# Altium project project_a_box.PrjPCB
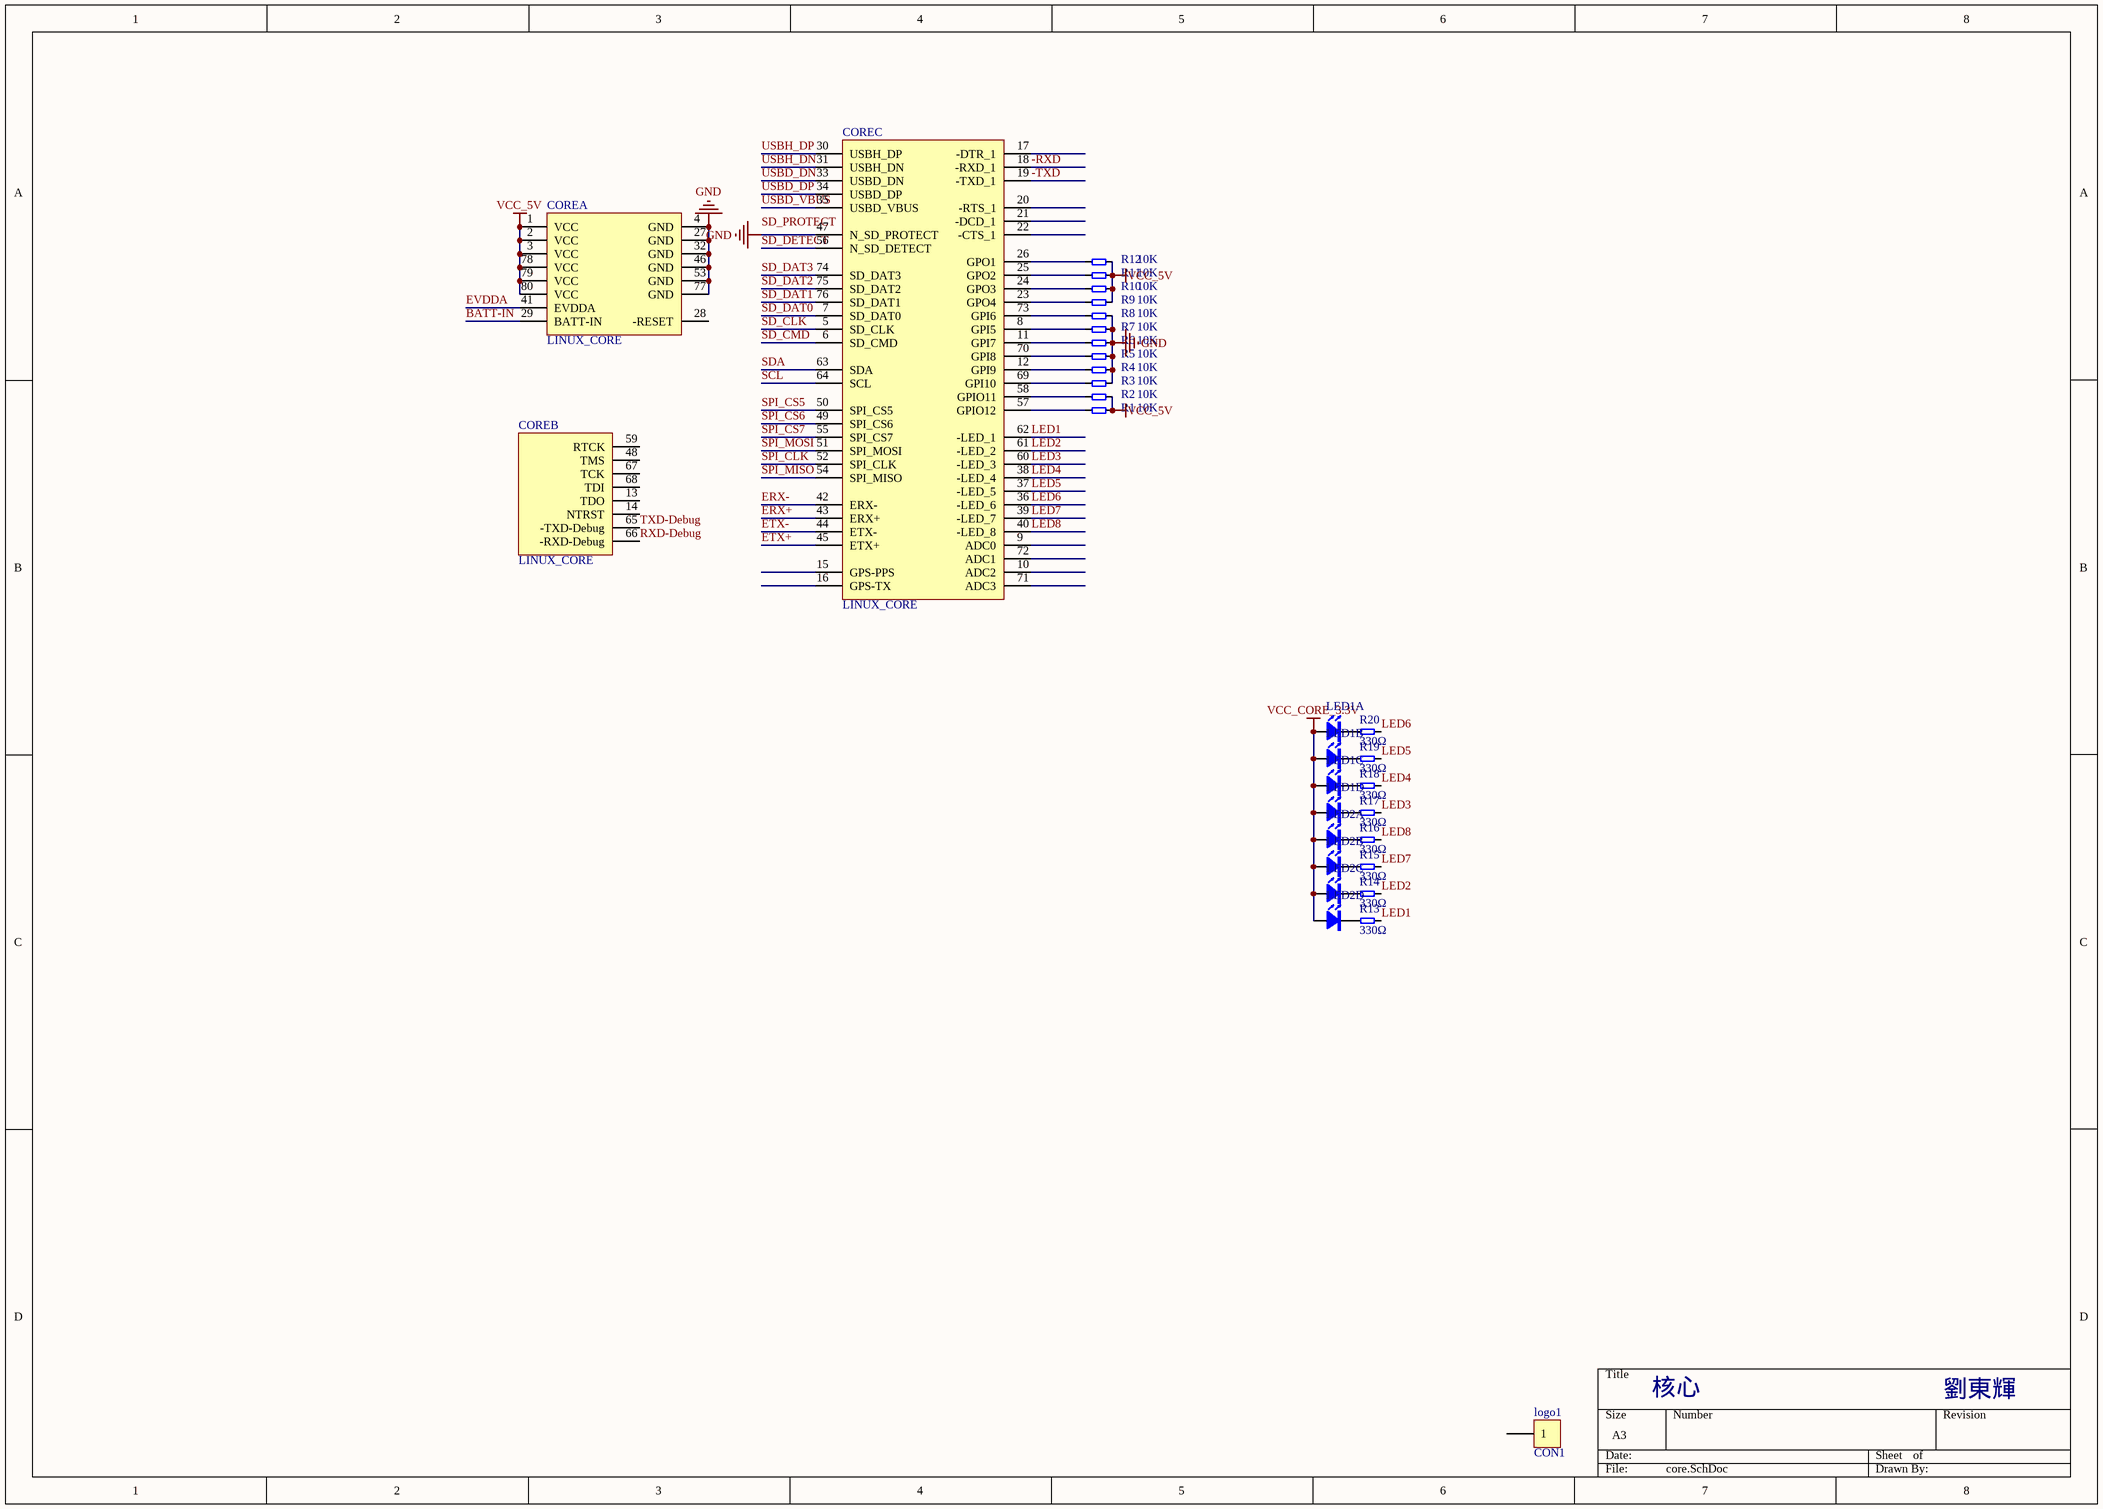
[diagram p0: core.SchDoc]
4 sheets, 100 parts. Net scope: global (net labels, ports and power ports of the same name join across sheets).
Board files: pcb.PcbDoc, panel.PcbDoc
Sheets:
  core.SchDoc
  Interface.SchDoc
  Power.SchDoc
  Ethernet.SchDoc

## Sheet core.SchDoc
size A3

### Parts
CORE  LINUX_CORE  [LINUX_CORE]  (parts A,B,C of 3)
LED1  (no value)  [3MM-4SYG/S530-Z]  (parts A,B,C,D of 4)
LED2  (no value)  [3MM-4SYG/S530-Z]  (parts A,B,C,D of 4)
logo1  CON1  [LIU]
R1  10K  [0805/2012 R3]
R2  10K  [0805/2012 R3]
R3  10K  [0805/2012 R3]
R4  10K  [0805/2012 R3]
R5  10K  [0805/2012 R3]
R6  10K  [0805/2012 R3]
R7  10K  [0805/2012 R3]
R8  10K  [0805/2012 R3]
R9  10K  [0805/2012 R3]
R10  10K  [0805/2012 R3]
R11  10K  [0805/2012 R3]
R12  10K  [0805/2012 R3]
R13  330Ω  [0805/2012 R3]
R14  330Ω  [0805/2012 R3]
R15  330Ω  [0805/2012 R3]
R16  330Ω  [0805/2012 R3]
R17  330Ω  [0805/2012 R3]
R18  330Ω  [0805/2012 R3]
R19  330Ω  [0805/2012 R3]
R20  330Ω  [0805/2012 R3]

### Nets
GND: CORE.4(GND) CORE.27(GND) CORE.32(GND) CORE.46(GND) CORE.47(N_SD_PROTECT) CORE.53(GND) CORE.77(GND) R3.2 R4.2 R5.2 R6.2 R7.2 R8.2
VCC_5V: CORE.1(VCC) CORE.2(VCC) CORE.3(VCC) CORE.78(VCC) CORE.79(VCC) CORE.80(VCC) R1.2 R2.2 R9.2 R10.2 R11.2 R12.2
VCC_CORE_3.3V: LED1.1(1A) LED1.3(2A) LED1.5(3A) LED1.7(4A) LED2.1(1A) LED2.3(2A) LED2.5(3A) LED2.7(4A)
-RXD: CORE.18(-RXD_1)
-TXD: CORE.19(-TXD_1)
BATT-IN: CORE.29(BATT-IN)
ERX+: CORE.43(ERX+)
ERX-: CORE.42(ERX-)
ETX+: CORE.45(ETX+)
ETX-: CORE.44(ETX-)
EVDDA: CORE.41(EVDDA)
LED1: CORE.62(-LED_1) R13.2
LED2: CORE.61(-LED_2) R14.2
LED3: CORE.60(-LED_3) R17.2
LED4: CORE.38(-LED_4) R18.2
LED5: CORE.37(-LED_5) R19.2
LED6: CORE.36(-LED_6) R20.2
LED7: CORE.39(-LED_7) R15.2
LED8: CORE.40(-LED_8) R16.2
RXD-Debug: CORE.66(-RXD-Debug)
SCL: CORE.64(SCL)
SD_CLK: CORE.5(SD_CLK)
SD_CMD: CORE.6(SD_CMD)
SD_DAT0: CORE.7(SD_DAT0)
SD_DAT1: CORE.76(SD_DAT1)
SD_DAT2: CORE.75(SD_DAT2)
SD_DAT3: CORE.74(SD_DAT3)
SD_DETECT: CORE.56(N_SD_DETECT)
SDA: CORE.63(SDA)
SPI_CLK: CORE.52(SPI_CLK)
SPI_CS5: CORE.50(SPI_CS5)
SPI_CS6: CORE.49(SPI_CS6)
SPI_CS7: CORE.55(SPI_CS7)
SPI_MISO: CORE.54(SPI_MISO)
SPI_MOSI: CORE.51(SPI_MOSI)
TXD-Debug: CORE.65(-TXD-Debug)
USBD_DN: CORE.33(USBD_DN)
USBD_DP: CORE.34(USBD_DP)
USBD_VBUS: CORE.35(USBD_VBUS)
USBH_DN: CORE.31(USBH_DN)
USBH_DP: CORE.30(USBH_DP)
NetCORE_8: CORE.8(GPI5) R7.1
NetCORE_11: CORE.11(GPI7) R6.1
NetCORE_12: CORE.12(GPI9) R4.1
NetCORE_23: CORE.23(GPO4) R9.1
NetCORE_24: CORE.24(GPO3) R10.1
NetCORE_25: CORE.25(GPO2) R11.1
NetCORE_26: CORE.26(GPO1) R12.1
NetCORE_57: CORE.57(GPIO12) R1.1
NetCORE_58: CORE.58(GPIO11) R2.1
NetCORE_69: CORE.69(GPI10) R3.1
NetCORE_70: CORE.70(GPI8) R5.1
NetCORE_73: CORE.73(GPI6) R8.1
NetLED1_2: LED1.2(1K) R20.1
NetLED1_4: LED1.4(2K) R19.1
NetLED1_6: LED1.6(3K) R18.1
NetLED1_8: LED1.8(4K) R17.1
NetLED2_2: LED2.2(1K) R16.1
NetLED2_4: LED2.4(2K) R15.1
NetLED2_6: LED2.6(3K) R14.1
NetLED2_8: LED2.8(4K) R13.1

Not connected (* = marked no-connect by the designer): CORE 9(ADC0) 10(ADC2) 13(TDO) 14(NTRST) 15(GPS-PPS) 16(GPS-TX) 17(-DTR_1) 20(-RTS_1) 21(-DCD_1) 22(-CTS_1) 28(-RESET) 48(TMS) 59(RTCK) 67(TCK) 68(TDI) 71(ADC3) 72(ADC1); logo1 1

### Notes on the sheet
- 核心
- 劉東輝
- Labels drawn without touching a wire or pin: SD_PROTECT

### Library data of the parts
LED1 LED2 = 3MM-4SYG/S530-Z
logo1 = CON1: Connector
R1-R20 = RES2: Resistor

## Sheet Interface.SchDoc
size A4
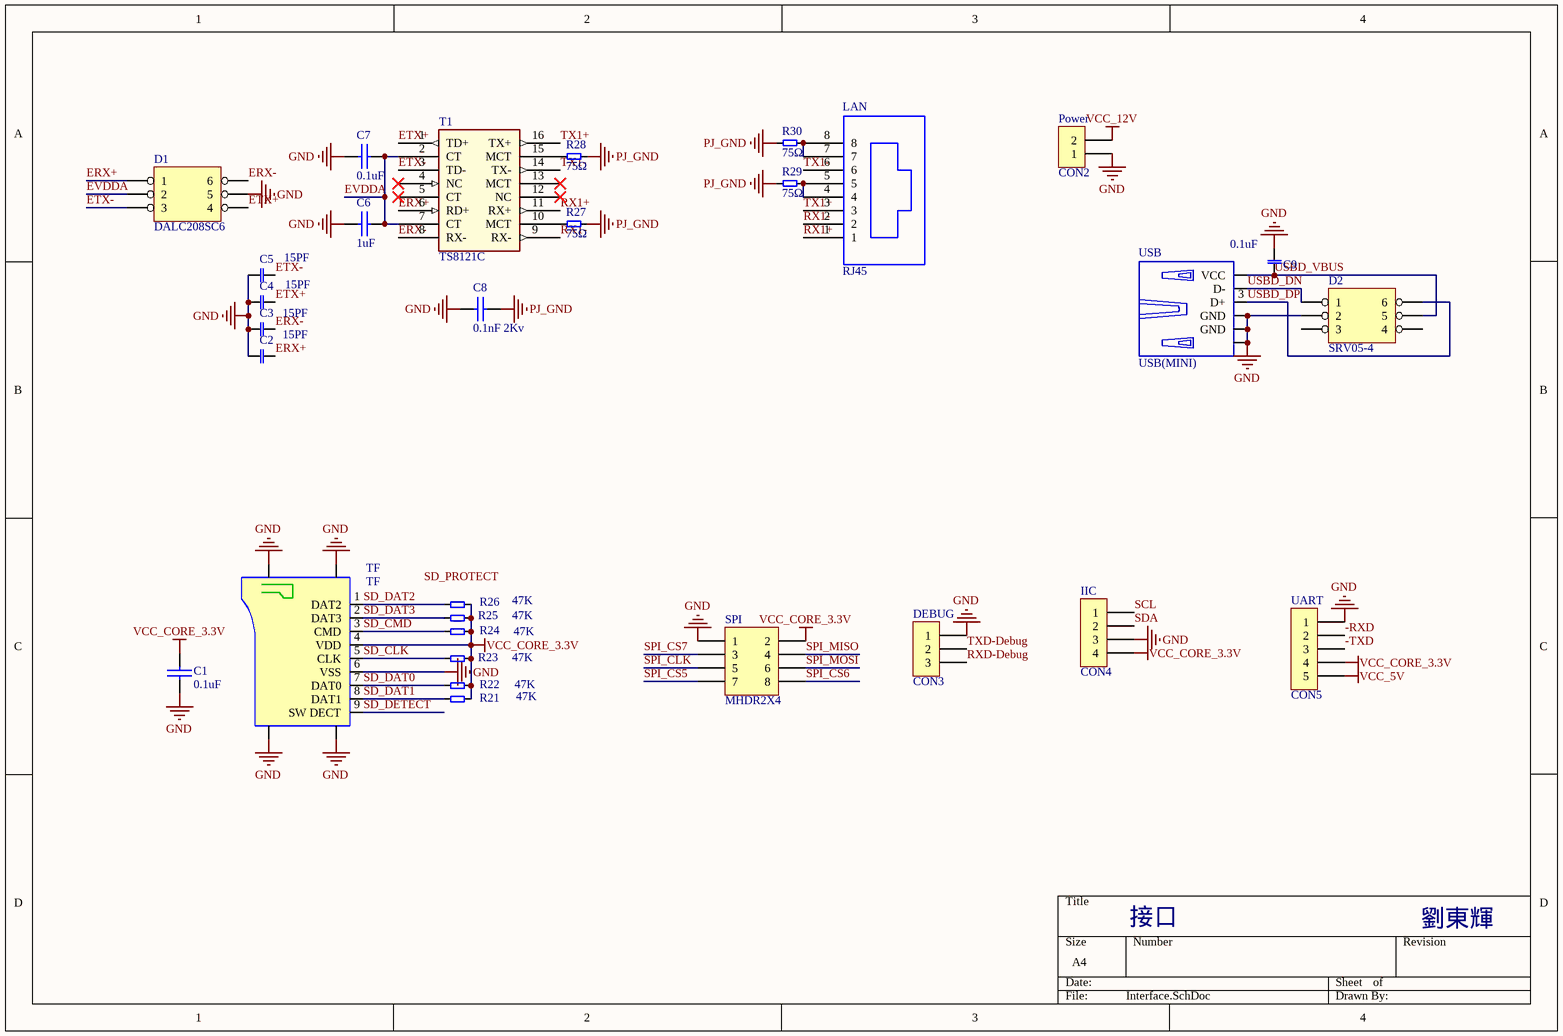
[diagram p1: Interface.SchDoc]

### Parts
C1  0.1uF  [0805/2012 C3]
C2  15PF  [0805/2012 C3]
C3  15PF  [0805/2012 C3]
C4  15PF  [0805/2012 C3]
C5  15PF  [0805/2012 C3]
C6  1uF  [0805/2012 C3]
C7  0.1uF  [0805/2012 C3]
C8  0.1nF 2Kv  [CAPRR508-350X650X700]
C9  0.1uF  [0805/2012 C3]
D1  DALC208SC6  [TSOT-23_6]
D2  SRV05-4  [TSOT-23_6]
DEBUG  CON3  [COMATEL_385.0358.1.03.400]
IIC  CON4  [COMATEL_385.0358.1.04.400]
LAN  RJ45  [RJ45_8P_8C]
Power  CON2  [B2P-VH]
R21  47K  [0805/2012 R3]
R22  47K  [0805/2012 R3]
R23  47K  [0805/2012 R3]
R24  47K  [0805/2012 R3]
R25  47K  [0805/2012 R3]
R26  47K  [0805/2012 R3]
R27  75Ω  [0805/2012 R3]
R28  75Ω  [0805/2012 R3]
R29  75Ω  [0805/2012 R3]
R30  75Ω  [0805/2012 R3]
SPI  MHDR2X4  [M20N-2X04-2.54]
T1  TS8121C  [XFMR_PULSE_H1260NL]
TF  TF  [TFP09-2-12B-G]
UART  CON5  [COMATEL_386.0358.1.05.440]
USB  USB(MINI)  [WURTH_651005136521]

### Nets
GND: C1.2 C2.2 C3.2 C4.1 C5.2 C6.1 C7.1 C8.2 C9.1 D1.5 D2.2 DEBUG.1 IIC.3 Power.1 SPI.1 TF.6(VSS) TF.10(GND) TF.11(GND) TF.12(GND) TF.13(GND) UART.1 USB.4(GND) USB.5(GND) USB.6
PJ_GND: C8.1 LAN.0(GND) R27.2 R28.2 R29.1 R30.1
VCC_5V: UART.5
VCC_12V: Power.2
VCC_CORE_3.3V: C1.1 IIC.4 R21.2 R22.2 R23.2 R24.2 R25.2 R26.2 SPI.2 TF.4(VDD) UART.4
-RXD: UART.2
-TXD: UART.3
ERX+: C2.1 D1.1 T1.6(RD+)
ERX-: C3.1 D1.6 T1.8(RX-)
ETX+: C4.2 D1.4 T1.1(TD+)
ETX-: C5.1 D1.3 T1.3(TD-)
EVDDA: C6.2 C7.2 D1.2 T1.2(CT) T1.7(CT)
RX1+: LAN.1 T1.11(RX+)
RX1-: LAN.2 T1.9(RX-)
RXD-Debug: DEBUG.3
SCL: IIC.1
SD_CLK: R23.1 TF.5(CLK)
SD_CMD: R24.1 TF.3(CMD)
SD_DAT0: R22.1 TF.7(DAT0)
SD_DAT1: R21.1 TF.8(DAT1)
SD_DAT2: R26.1 TF.1(DAT2)
SD_DAT3: R25.1 TF.2(DAT3)
SD_DETECT: TF.9(SW_DECT)
SDA: IIC.2
SPI_CLK: SPI.5
SPI_CS5: SPI.7
SPI_CS6: SPI.8
SPI_CS7: SPI.3
SPI_MISO: SPI.4
SPI_MOSI: SPI.6
TX1+: LAN.3 T1.16(TX+)
TX1-: LAN.6 T1.14(TX-)
TXD-Debug: DEBUG.2
USBD_DN: D2.1 USB.2(D-)
USBD_DP: D2.6 USB.3(D+)
USBD_VBUS: C9.2 D2.5 USB.1(VCC)
NetLAN_4: LAN.4 LAN.5 R29.2
NetLAN_7: LAN.7 LAN.8 R30.2
NetR27_1: R27.1 T1.10(MCT)
NetR28_1: R28.1 T1.15(MCT)

Not connected (* = marked no-connect by the designer): D2 3 4; T1 4(NC)* 5(CT)* 12(NC)* 13(MCT)*

### Notes on the sheet
- 接口
- 劉東輝
- Labels drawn without touching a wire or pin: SD_PROTECT

### Library data of the parts
C1 C6-C8 = Pro39.tmp_22P_32
C2-C5 C9 = CAP: Capacitor
D1 D2 = HEADER 3X2
DEBUG = CON3: Connector
IIC = CON4: Connector
Power = CON2: Connector
R21-R30 = RES2: Resistor
SPI = MHDR2X4: Header, 4-Pin, Dual row
UART = CON5: Connector
USB = USB(MINI): USB-MINI

## Sheet Power.SchDoc
size A4
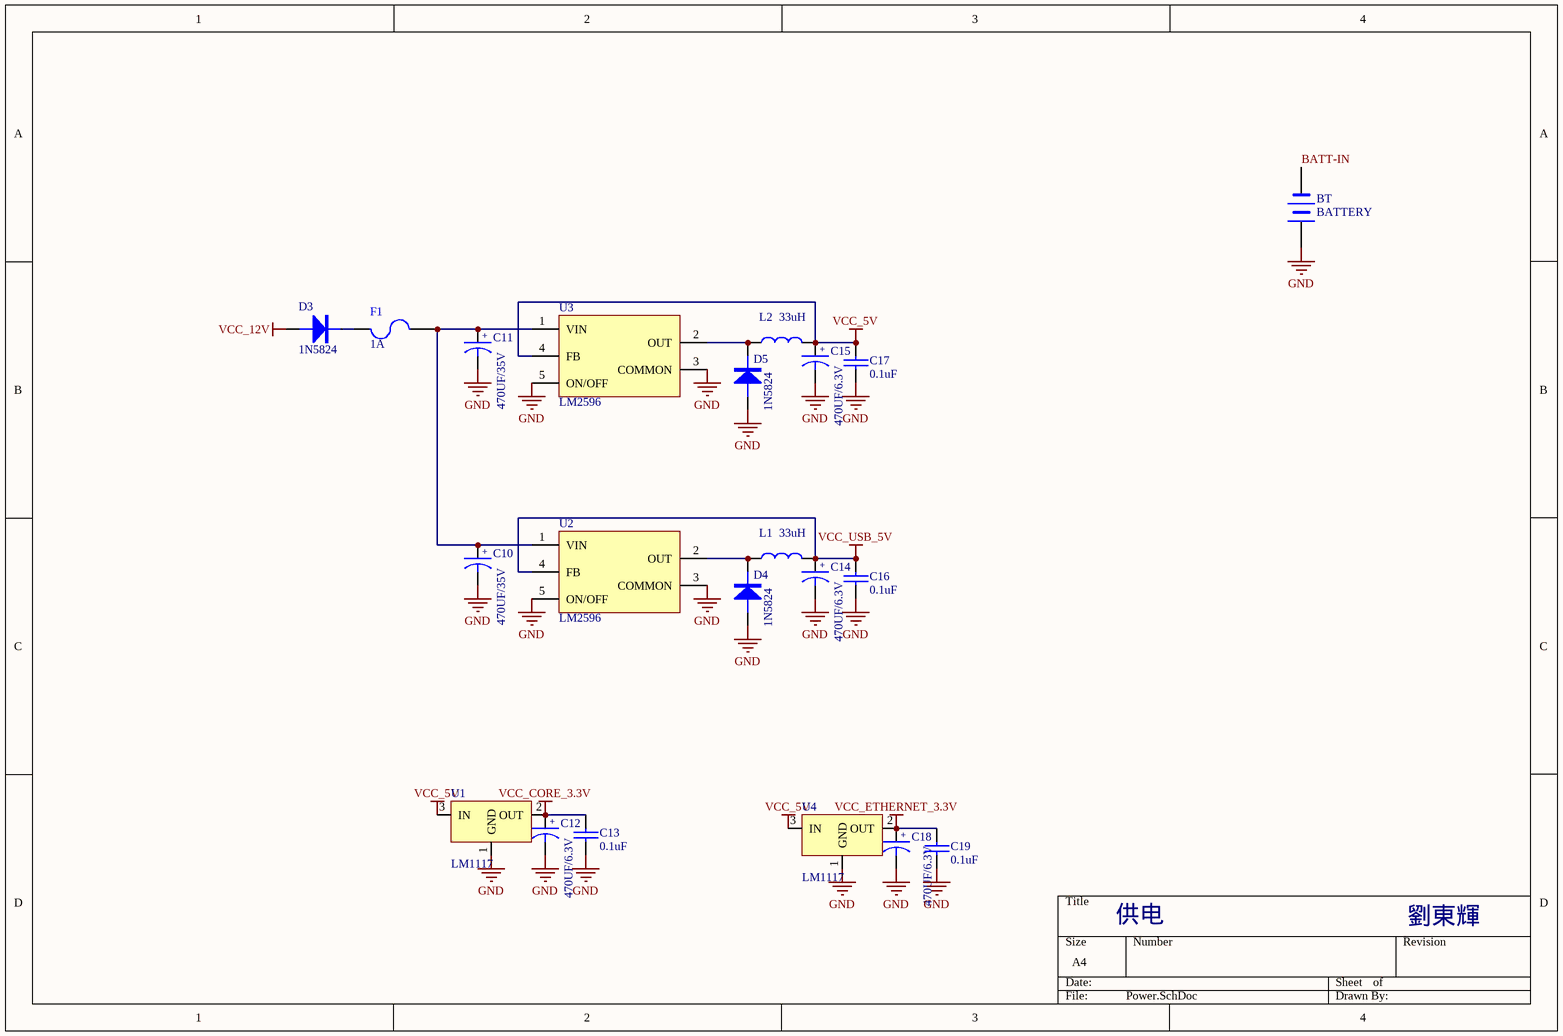
[diagram p2: Power.SchDoc]

### Parts
BT  BATTERY  [CR-1220]
C10  470UF/35V  [SMT_10X10_3-AECAP]
C11  470UF/35V  [SMT_10X10_3-AECAP]
C12  470UF/6.3V  [SMT_6_3X7_7-AECAP]
C13  0.1uF  [0805/2012 C3]
C14  470UF/6.3V  [SMT_6_3X7_7-AECAP]
C15  470UF/6.3V  [SMT_6_3X7_7-AECAP]
C16  0.1uF  [0805/2012 C3]
C17  0.1uF  [0805/2012 C3]
C18  470UF/6.3V  [SMT_6_3X7_7-AECAP]
C19  0.1uF  [0805/2012 C3]
D3  1N5824  [DO-214AC]
D4  1N5824  [DO-214AC]
D5  1N5824  [DO-214AC]
F1  1A  [FUSR_BOURNS_MF-MSMF_STYLE1(H85)]
L1  33uH  [MS125]
L2  33uH  [MS125]
U1  LM1117  [SOT-223]
U2  LM2596  [TO-263-B]
U3  LM2596  [TO-263-B]
U4  LM1117  [SOT-223]

### Nets
GND: BT.1(+) C10.2 C11.2 C12.2 C13.2 C14.2 C15.2 C16.2 C17.2 C18.2 C19.2 D4.1(A) D5.1(A) U1.1(GND) U2.0(GND) U2.3(COMMON) U2.5(ON/OFF) U3.0(GND) U3.3(COMMON) U3.5(ON/OFF) U4.1(GND)
VCC_5V: C15.1 C17.1 L2.1 U1.3(IN) U3.4(FB) U4.3(IN)
VCC_12V: D3.1(A)
VCC_CORE_3.3V: C12.1 C13.1 U1.2(OUT) U1.4(VCC_CORE_3.3V)
VCC_ETHERNET_3.3V: C18.1 C19.1 U4.2(OUT) U4.4(VCC_ETHERNET_3.3V)
VCC_USB_5V: C14.1 C16.1 L1.1 U2.4(FB)
BATT-IN: BT.2(-)
NetC10_1: C10.1 C11.1 F1.1 U2.1(VIN) U3.1(VIN)
NetD3_2: D3.2(K) F1.2
NetD4_2: D4.2(K) L1.2 U2.2(OUT)
NetD5_2: D5.2(K) L2.2 U3.2(OUT)

### Notes on the sheet
- 供电
- 劉東輝
- (in symbol 10UF/10V) +

### Library data of the parts
BT = BATTERY: pin to pad: 1>2 2>1
C10-C12 C14 C15 C18 = 10UF/10V: CCTC-106K010
C13 C16 C17 C19 = Pro39.tmp_22P_32
D3-D5 = 1N5819: CD-1N5819-DO41
F1 = Fuse 2: Fuse; Published: 8-Jun-2000; LatestRevisionDate: 17-Jul-2002; LatestRevisionNote: Re-released for DXP Platform.; PackageReference: PIN-W2/E2.8; Publisher: Altium Limited
L1 L2 = 100UH-SLF7032: CL-SLF7032-101
U2 U3 = LM2596: CI-LM2575T-5.0

## Sheet Ethernet.SchDoc
size A3
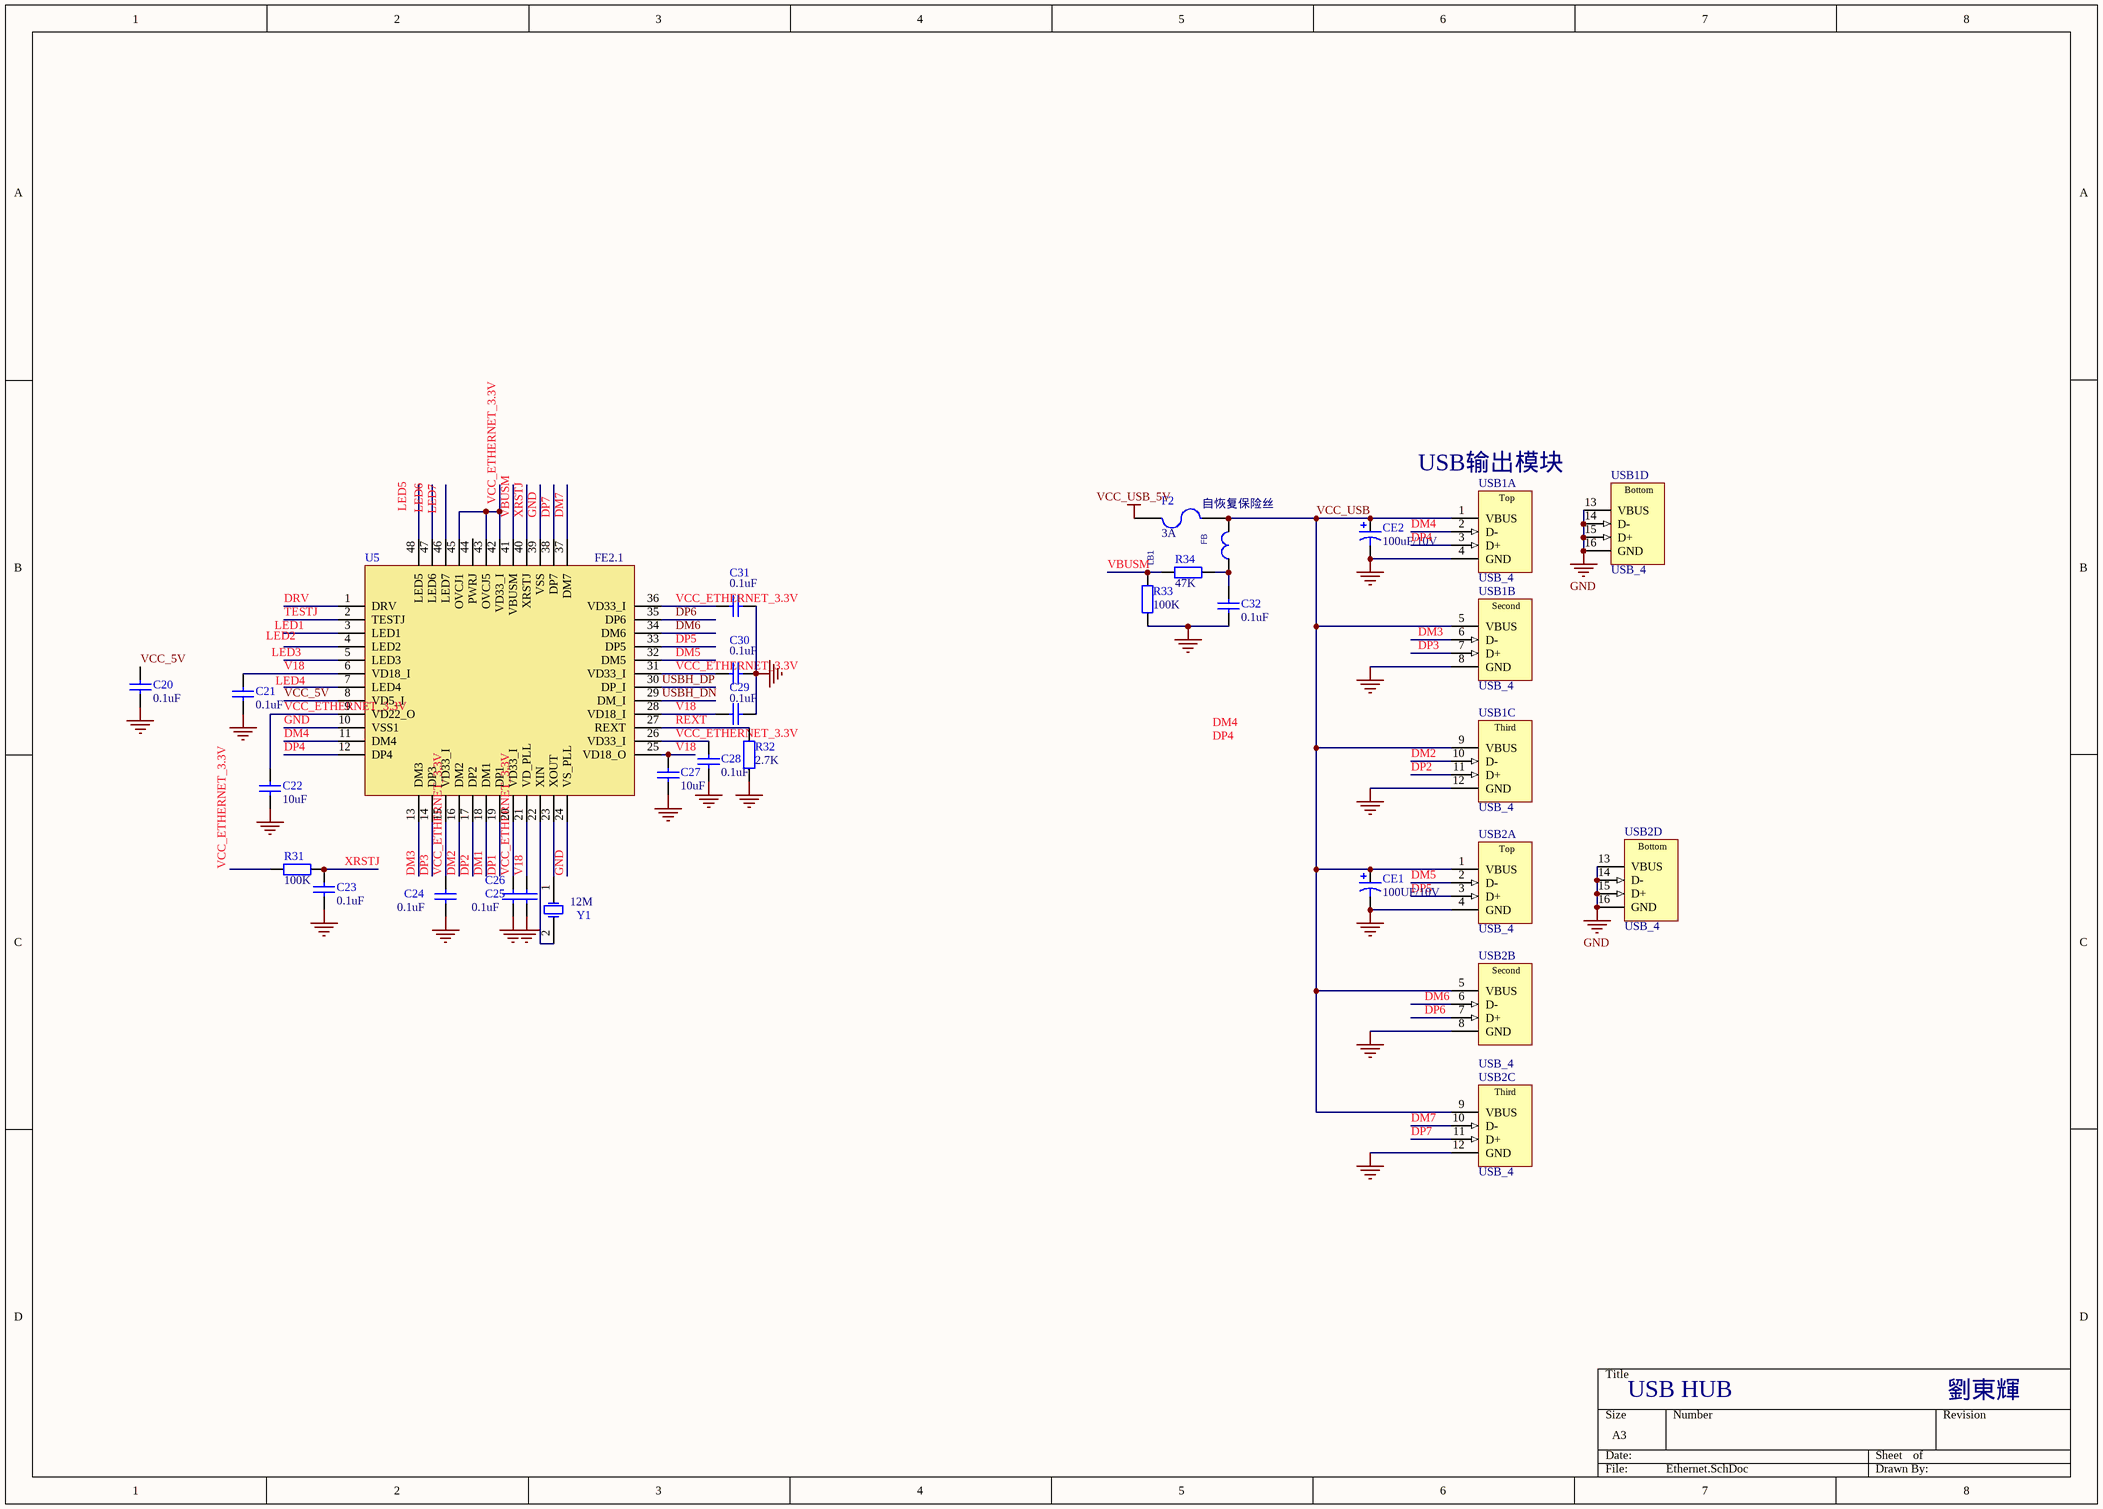
[diagram p3: Ethernet.SchDoc]

### Parts
C20  0.1uF  [0805/2012 C3]
C21  0.1uF  [0805/2012 C3]
C22  10uF  [0805/2012 C3]
C23  0.1uF  [0805/2012 C3]
C24  0.1uF  [0805/2012 C3]
C25  0.1uF  [0805/2012 C3]
C26  0.1uF  [0805/2012 C3]  (value not drawn)
C27  10uF  [0805/2012 C3]
C28  0.1uF  [0805/2012 C3]
C29  0.1uF  [0805/2012 C3]
C30  0.1uF  [0805/2012 C3]
C31  0.1uF  [0805/2012 C3]
C32  0.1uF  [0805/2012 C3]
CE1  100UF/10V  [2312_6023-20_SMT-TAJ-F]
CE2  100uF/10V  [2312_6023-20_SMT-TAJ-F]
F2  3A  [FUSR_BOURNS_MF-MSMF_STYLE1(H85)]
LB1  FB  [0805/2012 F3]
R31  100K  [0805/2012 R3]
R32  2.7K  [0805/2012 R3]
R33  100K  [0805/2012 R3]
R34  47K  [0805/2012 R3]
U5  FE2.1  [LQFP-48L]
USB1  USB_4  [USB-3]  (parts A,B,C,D of 5)
USB2  USB_4  [USB-3]  (parts A,B,C,D of 5)
Y1  12M  [XTAL_CITIZEN_HCM49]

### Nets
GND: C20.1 C21.1 C22.1 C23.1 C24.1 C25.1 C26.1 C27.1 C28.1 C29.1 C30.1 C31.1 C32.1 CE1.2 CE2.2 R32.1 R33.1 U5.10(VSS1) U5.24(VS_PLL) U5.39(VSS) USB1.4(GND) USB1.8(GND) USB1.12(GND) USB1.13(VBUS) USB1.14(D-) USB1.15(D+) USB1.16(GND) USB2.4(GND) USB2.8(GND) USB2.12(GND) USB2.13(VBUS) USB2.14(D-) USB2.15(D+) USB2.16(GND)
VCC_5V: C20.2 U5.8(VD5_I)
VCC_ETHERNET_3.3V: C22.2 C24.2 C25.2 C28.2 C30.2 C31.2 R31.1 U5.9(VD22_O) U5.15(VD33_I) U5.20(VD33_I) U5.26(VD33_I) U5.31(VD33_I) U5.36(VD33_I) U5.42(VD33_I) U5.43(OVCJ5) U5.45(OVCJ1)
VCC_USB_5V: F2.2
DM1: U5.18(DM1)
DM2: U5.16(DM2) USB1.10(D-)
DM3: U5.13(DM3) USB1.6(D-)
DM4: U5.11(DM4) USB1.2(D-)
DM5: U5.32(DM5) USB2.2(D-)
DM6: U5.34(DM6) USB2.6(D-)
DM7: U5.37(DM7) USB2.10(D-)
DP1: U5.19(DP1)
DP2: U5.17(DP2) USB1.11(D+)
DP3: U5.14(DP3) USB1.7(D+)
DP4: U5.12(DP4) USB1.3(D+)
DP5: U5.33(DP5) USB2.3(D+)
DP6: U5.35(DP6) USB2.7(D+)
DP7: U5.38(DP7) USB2.11(D+)
DRV: U5.1(DRV)
REXT: R32.2 U5.27(REXT)
TESTJ: U5.2(TESTJ)
USBH_DN: U5.29(DM_I)
USBH_DP: U5.30(DP_I)
V18: C21.2 C26.2 C27.2 C29.2 U5.6(VD18_I) U5.21(VD_PLL) U5.25(VD18_O) U5.28(VD18_I)
VBUSM: R33.2 R34.2 U5.41(VBUSM)
VCC_USB: CE1.1 CE2.1 F2.1 LB1.2 USB1.1(VBUS) USB1.5(VBUS) USB1.9(VBUS) USB2.1(VBUS) USB2.5(VBUS) USB2.9(VBUS)
XRSTJ: C23.2 R31.2 U5.40(XRSTJ)
NetC32_2: C32.2 LB1.1 R34.1
NetU5_22: U5.22(XIN) Y1.2(OSC2)
NetU5_23: U5.23(XOUT) Y1.1(OSC1)

Not connected (* = marked no-connect by the designer): U5 3(LED1) 4(LED2) 5(LED3) 7(LED4) 44(PWRJ) 46(LED7) 47(LED6) 48(LED5)

### Notes on the sheet
- (near F2) 自恢复保险丝
- (near USB1) USB输出模块
- USB HUB
- 劉東輝
- Labels drawn without touching a wire or pin: DM4, DP4, LED1, LED2, LED3, LED4, LED5, LED6, LED7
- (in symbol USB_4, part A) Top
- (in symbol USB_4, part B) Second
- (in symbol USB_4, part C) Third
- (in symbol USB_4, part D) Bottom

### Library data of the parts
C20-C32 = Cap: Capacitor
  C20-C22 C24 C27 C30: Published: *; LatestRevisionDate: *; LatestRevisionNote: *; PackageReference: *; Publisher: *; Value: *
  C23 C25 C26 C28 C29 C31 C32: Published: 8-Jun-2000; LatestRevisionDate: 17-Jul-2002; LatestRevisionNote: Re-released for DXP Platform.; PackageReference: RAD-0.3; Publisher: Altium Limited
CE1 CE2 = Cap Pol1: Polarized Capacitor (Radial)
  CE1: Published: 8-Jun-2000; LatestRevisionDate: 17-Jul-2002; LatestRevisionNote: Re-released for DXP Platform.; PackageReference: RB7.6-15; Publisher: Altium Limited
  CE2: Published: *; LatestRevisionDate: *; LatestRevisionNote: *; PackageReference: *; Publisher: *; Value: *
F2 = Fuse 2: Fuse; Published: 8-Jun-2000; LatestRevisionDate: 17-Jul-2002; LatestRevisionNote: Re-released for DXP Platform.; PackageReference: PIN-W2/E2.8; Publisher: Altium Limited
LB1 = FB-0805
R31-R34 = Res2: Resistor
  R31 R33 R34: Published: 8-Jun-2000; LatestRevisionDate: 17-Jul-2002; LatestRevisionNote: Re-released for DXP Platform.; PackageReference: AXIAL-0.4; Publisher: Altium Limited
  R32: Published: *; LatestRevisionDate: *; LatestRevisionNote: *; PackageReference: *; Publisher: *; Value: *
U5 = F2.1
USB1 USB2 = USB_4: USB 1.1, Right Angle, Thru-Hole, A Type, Receptacle, 4x4x4x4 Position, Fourfold Stacked, Black; ContactMaterial: Phosphor Bronze; ContactPlating: Gold (30) over Nickel (50); TerminationLength: 2.36mm [0.093in.]; PCB_Layout: Complies with manufacturer's recommendation.; DrillSize: Corresponds to nominal value.; PanelGround: Without; Published: 15-Jul-2004; DatasheetDocument: 30-Jul-2002; PackageDocument: 30-Jul-2002; PackageReference: 1470007; Publisher: Altium Limited; HousingMaterial: 30% Glass-Filled Thermoplastic; ComponentLink1Description: Manufacturer Link; ComponentLink1URL: http://www.tycoelectronics.com/; ComponentLink2Description: Packaging Specification; ComponentLink2URL: http://ecommas.tycoelectronics.com/commerce/DocumentDelivery/DDEController?Action=showdoc&DocId=Customer+Drawing%7F1470007%7FO%7Fpdf%7FEnglish%7FENG_CD_1470007_O.pdf
Y1 = XTAL: Crystal Oscillator; Published: *; LatestRevisionDate: *; LatestRevisionNote: *; PackageReference: *; Publisher: *

## Nets that join several sheets
GND: core (13 pins), Interface (24 pins), Power (21 pins), Ethernet (34 pins)
VCC_5V: core (12 pins), Interface (UART.5), Power (6 pins), Ethernet (C20.2 U5.8)
VCC_12V: Interface (Power.2), Power (D3.1)
VCC_CORE_3.3V: core (8 pins), Interface (11 pins), Power (C12.1 C13.1 U1.2 U1.4)
VCC_ETHERNET_3.3V: Power (C18.1 C19.1 U4.2 U4.4), Ethernet (16 pins)
VCC_USB_5V: Power (C14.1 C16.1 L1.1 U2.4), Ethernet (F2.2)
-RXD: core (CORE.18), Interface (UART.2)
-TXD: core (CORE.19), Interface (UART.3)
BATT-IN: core (CORE.29), Power (BT.2)
ERX+: core (CORE.43), Interface (C2.1 D1.1 T1.6)
ERX-: core (CORE.42), Interface (C3.1 D1.6 T1.8)
ETX+: core (CORE.45), Interface (C4.2 D1.4 T1.1)
ETX-: core (CORE.44), Interface (C5.1 D1.3 T1.3)
EVDDA: core (CORE.41), Interface (5 pins)
RXD-Debug: core (CORE.66), Interface (DEBUG.3)
SCL: core (CORE.64), Interface (IIC.1)
SD_CLK: core (CORE.5), Interface (R23.1 TF.5)
SD_CMD: core (CORE.6), Interface (R24.1 TF.3)
SD_DAT0: core (CORE.7), Interface (R22.1 TF.7)
SD_DAT1: core (CORE.76), Interface (R21.1 TF.8)
SD_DAT2: core (CORE.75), Interface (R26.1 TF.1)
SD_DAT3: core (CORE.74), Interface (R25.1 TF.2)
SD_DETECT: core (CORE.56), Interface (TF.9)
SDA: core (CORE.63), Interface (IIC.2)
SPI_CLK: core (CORE.52), Interface (SPI.5)
SPI_CS5: core (CORE.50), Interface (SPI.7)
SPI_CS6: core (CORE.49), Interface (SPI.8)
SPI_CS7: core (CORE.55), Interface (SPI.3)
SPI_MISO: core (CORE.54), Interface (SPI.4)
SPI_MOSI: core (CORE.51), Interface (SPI.6)
TXD-Debug: core (CORE.65), Interface (DEBUG.2)
USBD_DN: core (CORE.33), Interface (D2.1 USB.2)
USBD_DP: core (CORE.34), Interface (D2.6 USB.3)
USBD_VBUS: core (CORE.35), Interface (C9.2 D2.5 USB.1)
USBH_DN: core (CORE.31), Ethernet (U5.29)
USBH_DP: core (CORE.30), Ethernet (U5.30)